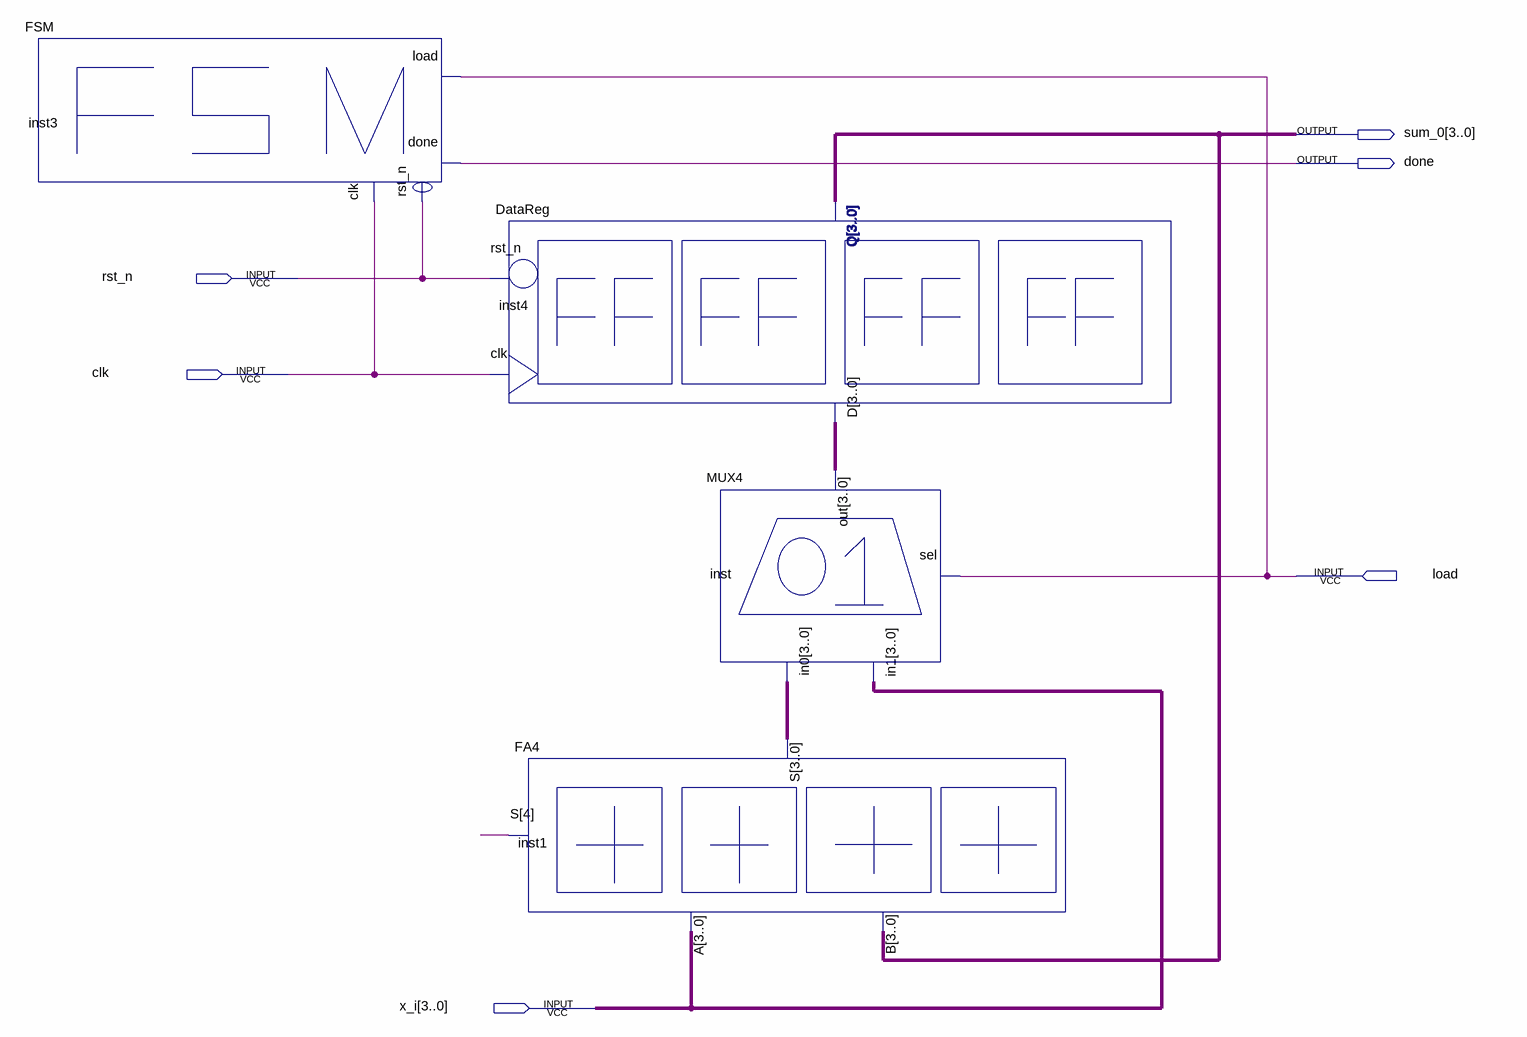
[diagram p0: schematic sheet]
// Quartus schematic AC4.bdf as structural Verilog: 4 symbols, 6 pins
module AC4 (
  input  rst_n,
  input  clk,
  input  load,
  input  [3:0] x_i,
  output [3:0] sum_0,
  output done
);

  wire inst1_s;
  wire [3:0] inst1_s_2, inst_out;

  FSM inst3 (.rst_n(rst_n), .clk(clk), .load(load), .done(done));
  DataReg inst4 (.D(inst_out), .rst_n(rst_n), .clk(clk), .Q(sum_0));
  FA4 inst1 (.A(x_i), .B(sum_0), .S({inst1_s, inst1_s_2}));
  MUX4 inst (.in0(inst1_s_2), .in1(x_i), .sel(load), .out(inst_out));
endmodule
